# EAGLE board PCB2 (EAGLE 9.3.1)
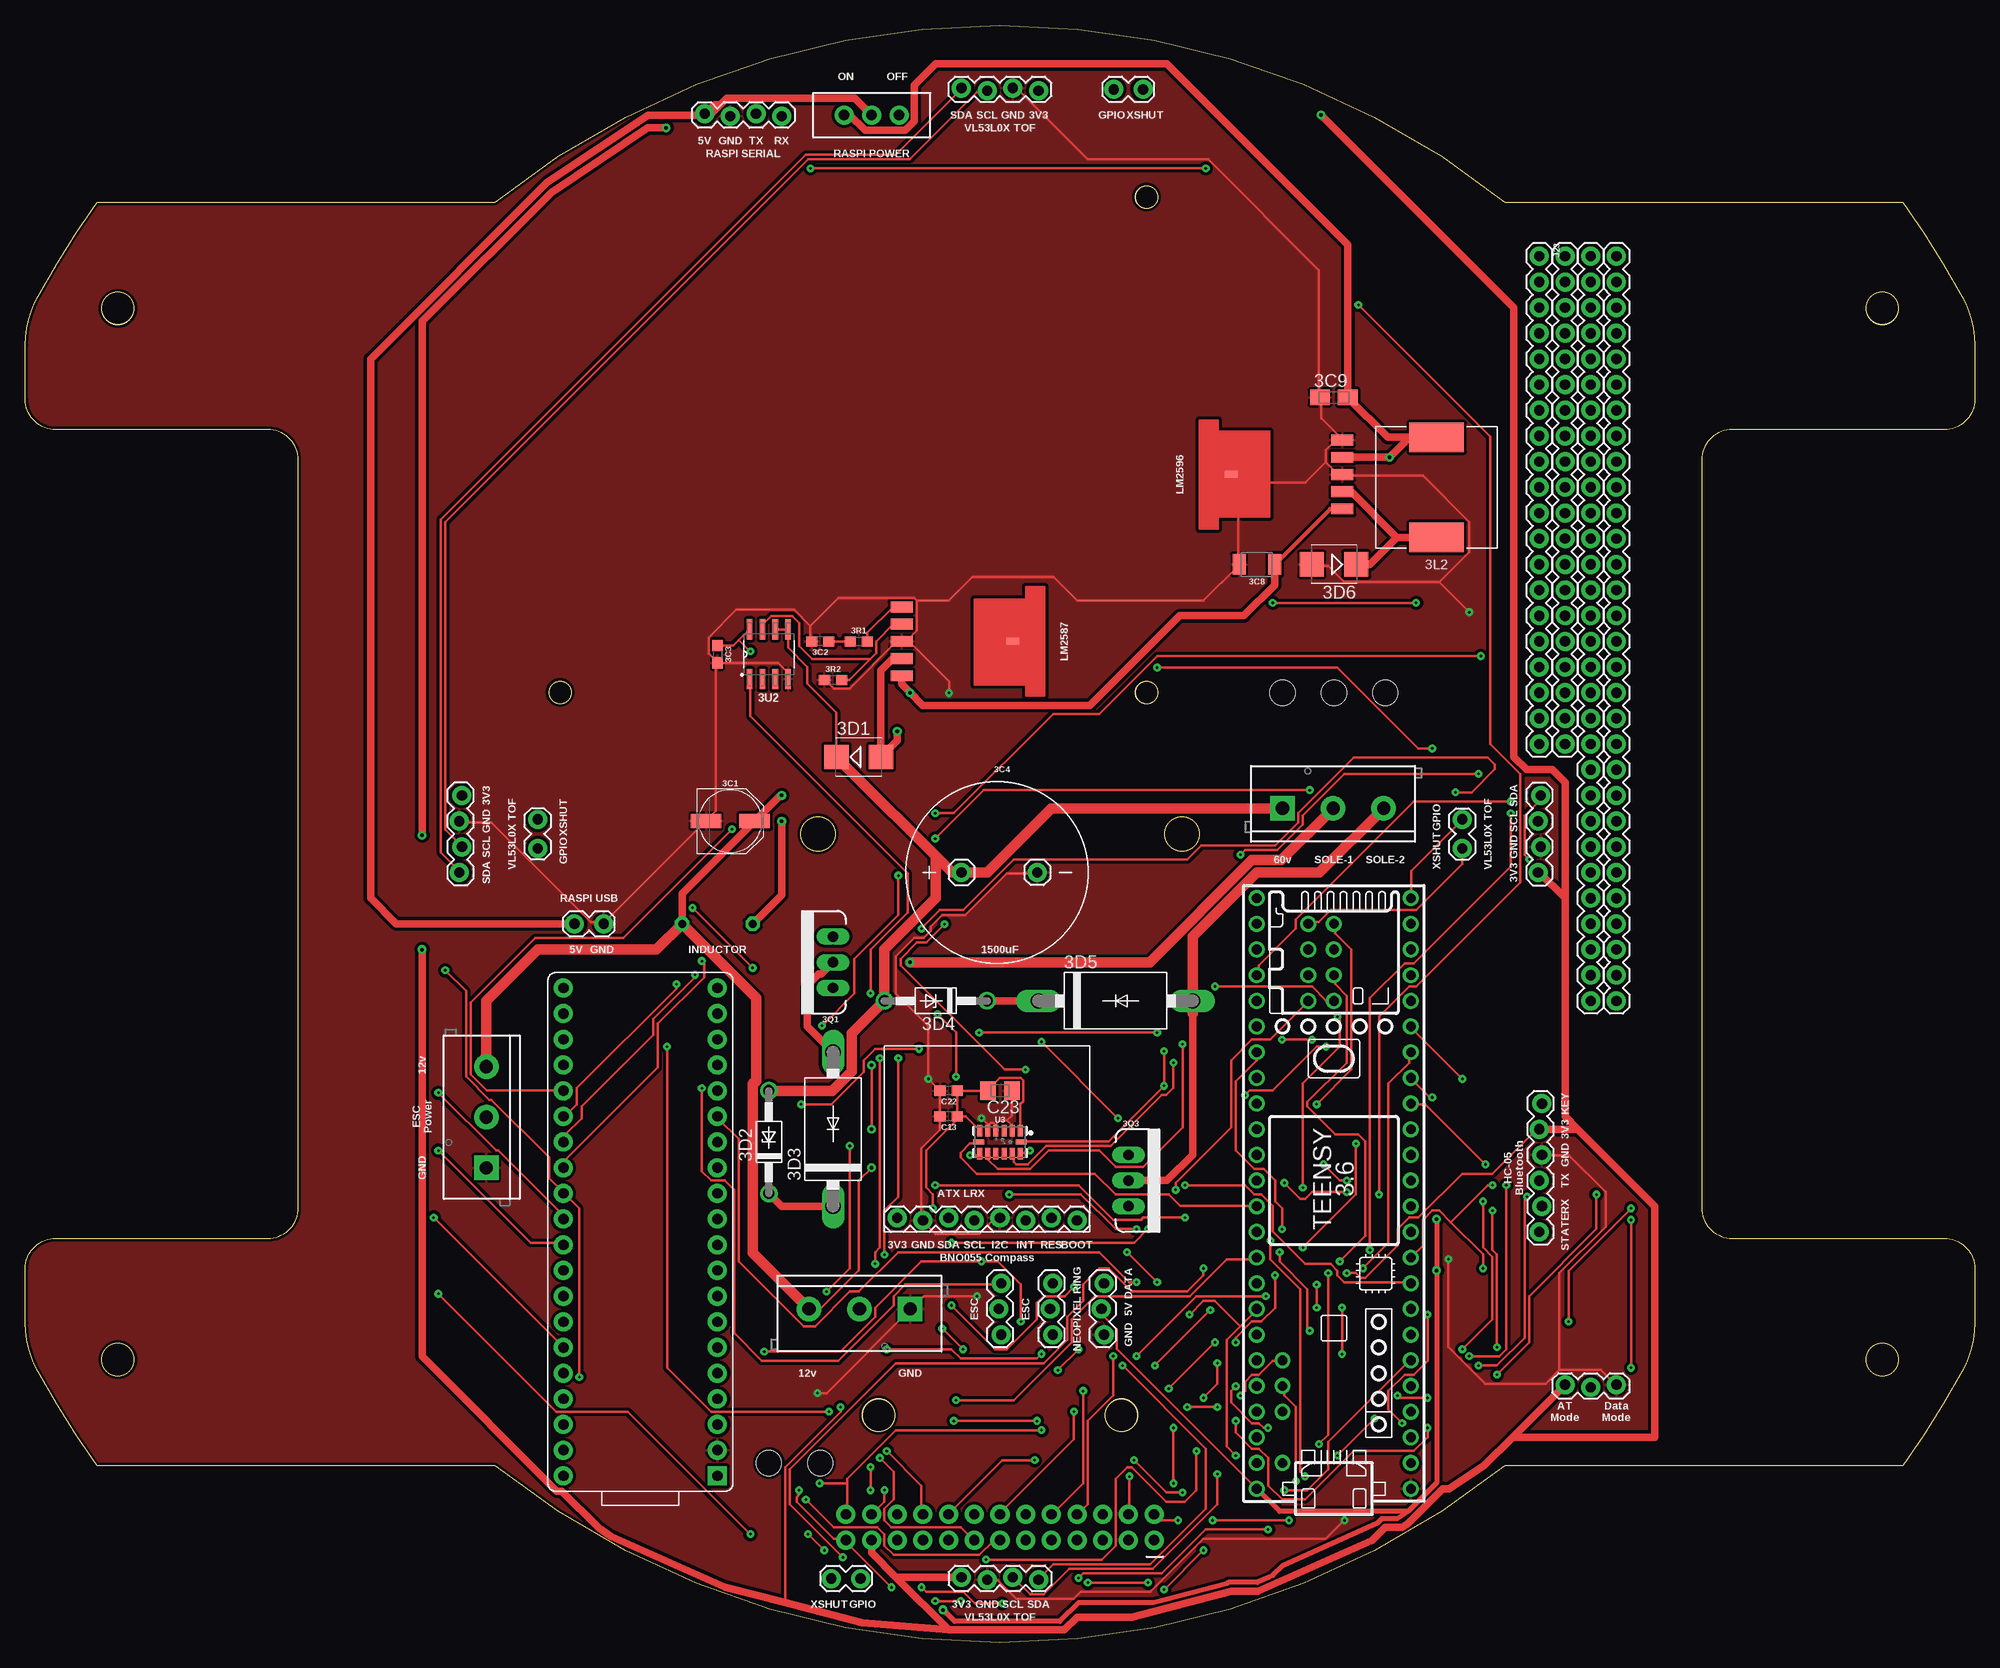
[diagram p2: board, top side]
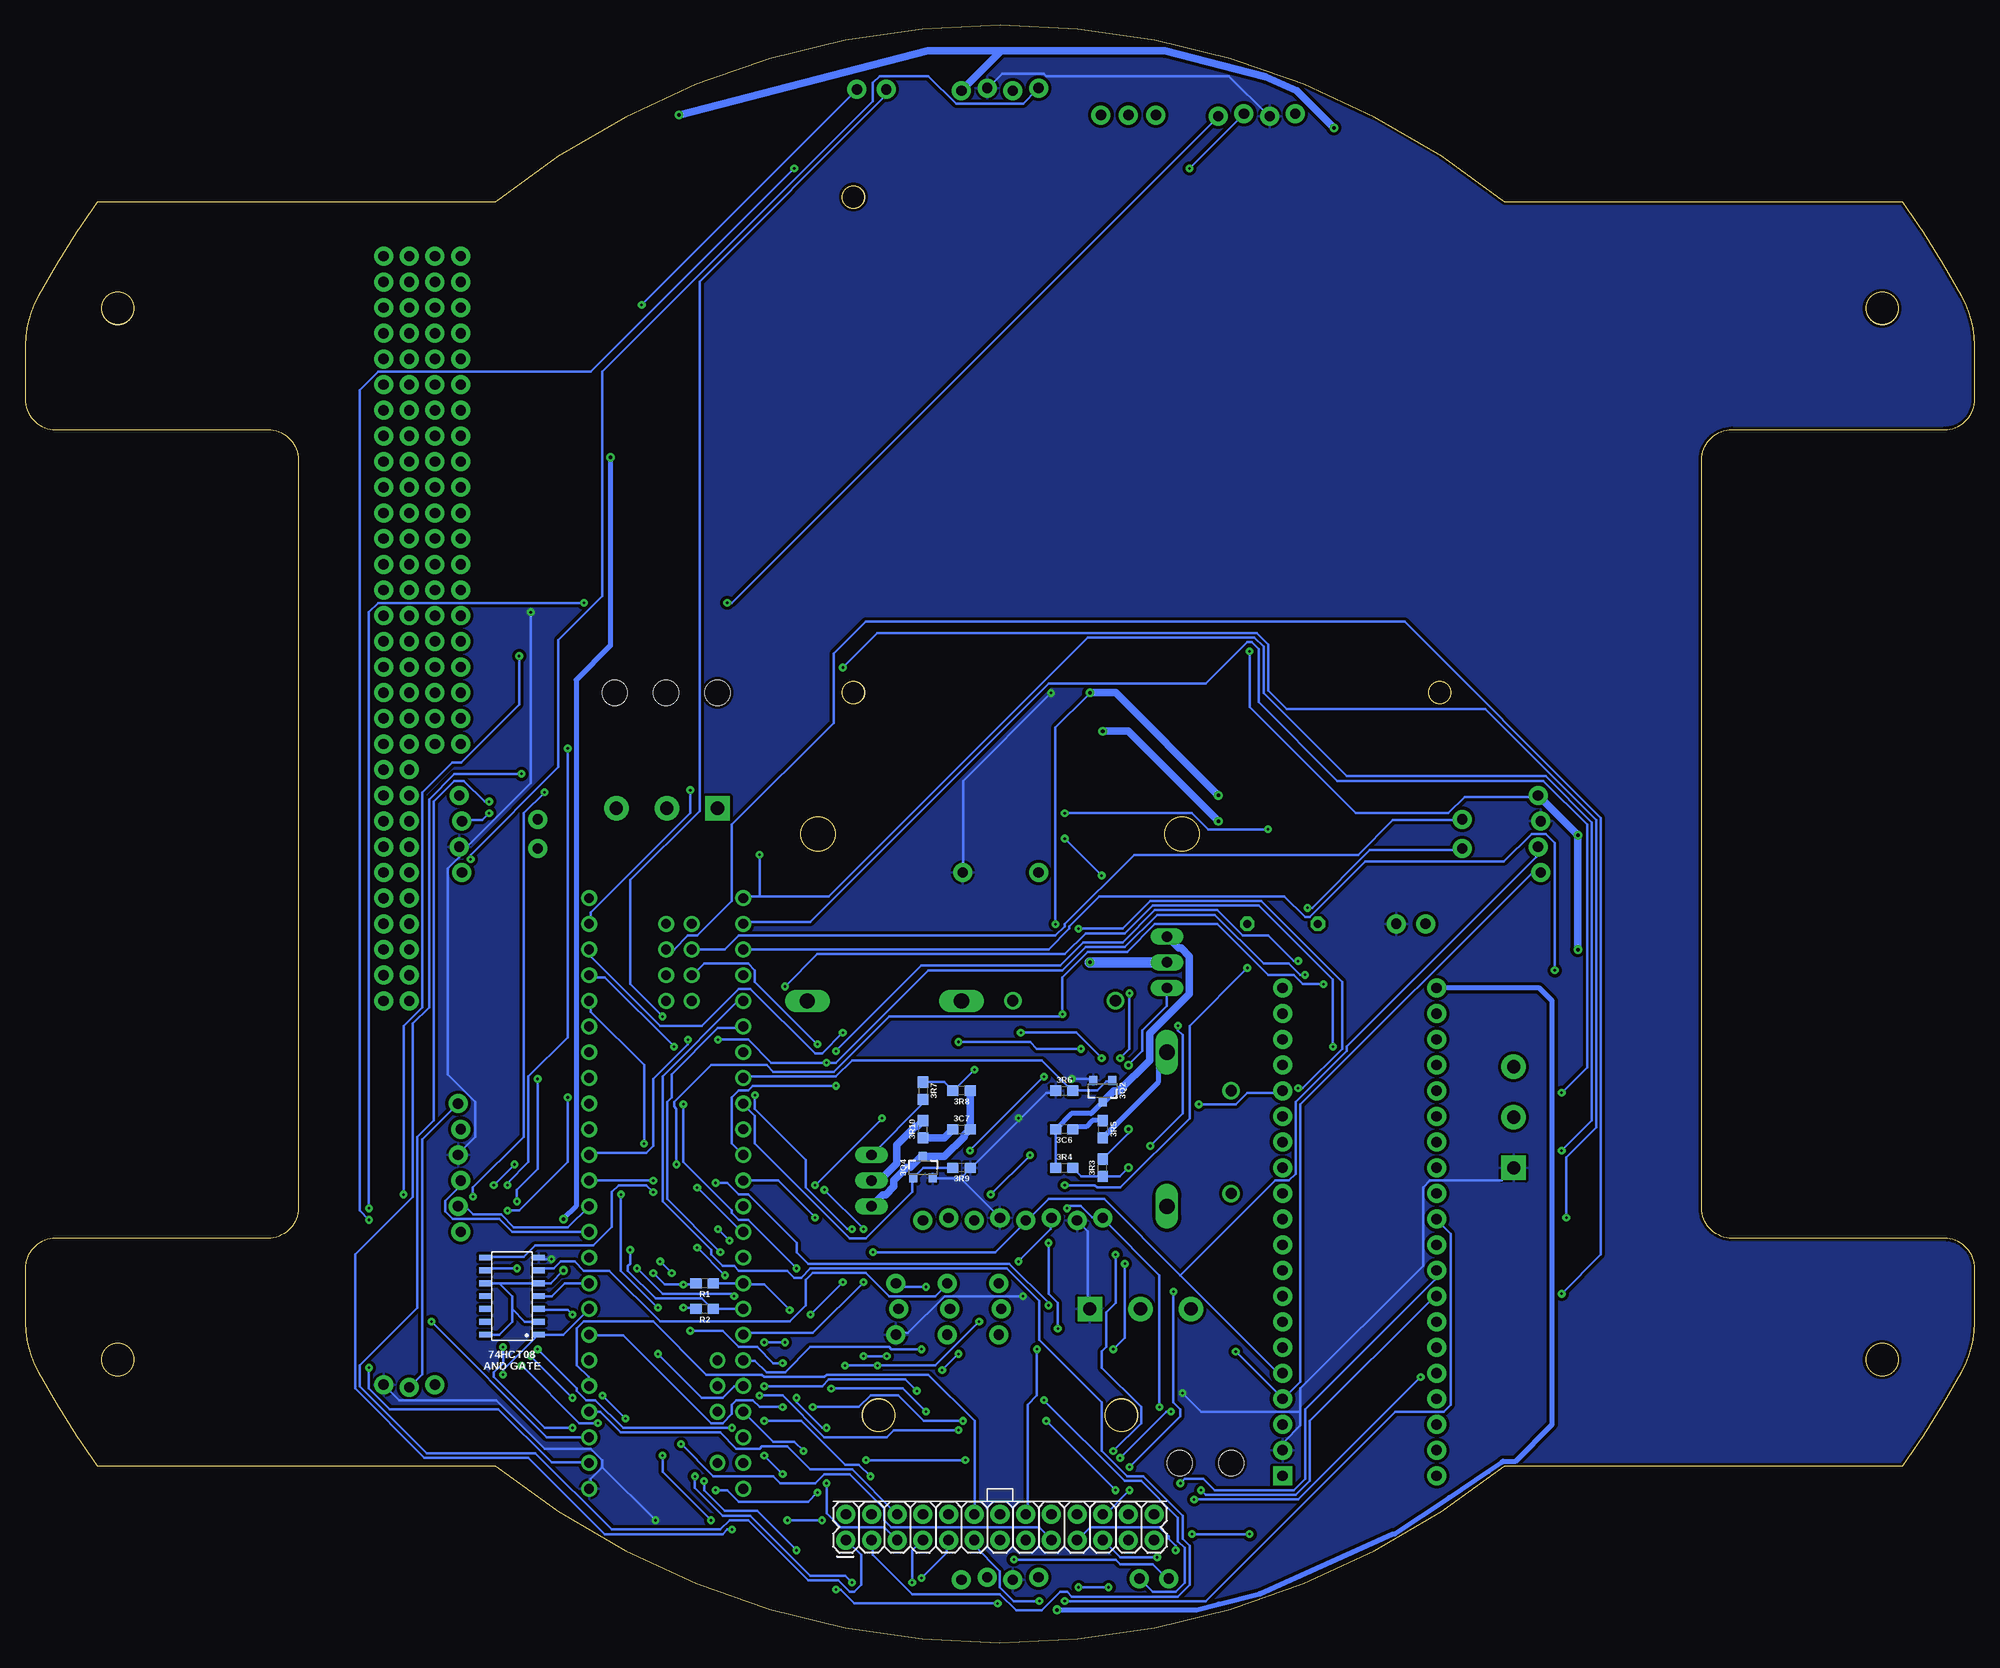
[diagram p3: board, bottom side, seen from below]

Size 192.79 x 160 mm. Coordinates in mm from the lower left corner, seen from the top.
Outline: 1.27,133.22 arc-6 7.11,142.52 46.48,142.52 arc-77 146.31,142.52 185.68,142.52 arc-6 191.52,133.22 arc-29 192.79,128.34 192.79,123 arc-90 189.79,120 168.8,120 arc90 165.8,117 165.8,43 arc90 168.8,40 189.79,40 arc-90 192.79,37 192.79,31.66 arc-29 191.52,26.77 arc-6 185.68,17.48 146.31,17.48 arc-77 46.48,17.48 7.11,17.48 arc-6 1.27,26.77 arc-29 0,31.66 0,37 arc-90 3,40 24,40 arc90 27,43 27,117 arc90 24,120 3,120 arc-90 0,123 0,128.34 arc-29 1.27,133.22
Outline: circle at 108.4,22.5 radius 1.6
Outline: circle at 84.4,22.5 radius 1.6
Outline: circle at 9.15,132 radius 1.6
Outline: circle at 183.64,132 radius 1.6
Outline: circle at 9.15,28 radius 1.6
Outline: circle at 183.64,28 radius 1.6
Outline: circle at 114.4,80 radius 1.7
Outline: circle at 78.4,80 radius 1.7
Outline: circle at 110.9,94 radius 1.1
Outline: circle at 110.9,143 radius 1.1
Outline: circle at 52.9,94 radius 1.1
Copper layers (1*16): Top 0.035mm / dielectric 1.5mm / Bottom 0.035mm
Design rules "mine *": minimum track width 10mil, minimum drill 10mil, track to track 8mil, track to pad 8mil, pad to pad 8mil, via to via 8mil, smd to smd 8mil, copper to edge 8mil, drill to drill 8mil, minimum pad ring 12mil, minimum via ring 10mil, stop-mask expansion 4mil, vias tented up to drill 25mil, thermal gap 10mil
Holes 2.5 mm at 73.54,17.77 78.62,17.77 129.42,93.97 134.5,93.97 124.34,93.97
Holes 3.2 mm at 9.15,132 9.15,28 84.4,22.5 108.4,22.5 183.64,28 183.64,132
Holes 3.4 mm at 114.4,80 78.4,80
Holes 2.2 mm at 52.9,94 110.9,94 110.9,143

## Footprints (pad centres in the part's own frame; a part is rotated, then mirrored left to right if it is on the bottom)
PANASONIC_D = smd 3 x 1.4: + 2.4,0; - -2.4,0
0603 = smd 1.1 x 1: 1 -0.85,0; 2 0.85,0
1000UF-CAP = drill 1.016 pad 1.88: + 0,0; - 7.5,0
1210 = smd 1.27 x 2.06: 1 -1.755,0; 2 1.755,0
A/3216-18R = smd 1.95 x 1.5: + 1.375,0; - -1.375,0
SMB = smd 2.4 x 2.4: A 2.2,0; C -2.2,0
DO41Z10 = drill 1.118: A 5.08,0; C -5.08,0
DO201-15 = drill 1.499 long: A 7.62,0; C -7.62,0
SCREWTERMINAL-5MM-3 = drill 1.3 pad 2.413 square: 1 0,0 | drill 1.3 pad 2.413: 2 5,0; 3 10,0
100UH-L = drill 0.8 octagon: P1 -3.5,0; P2 3.5,0
127 = smd 5.4 x 2.9: 1 0,4.95; 2 0,-4.95
TO220V = drill 1.016 long: 1 -2.54,0; 2 0,0; 3 2.54,0
SOT23-3 = smd 0.8 x 0.9: 1 -0.95,-1; 2 0.95,-1; 3 0,1.1
TO-263 = smd 2.16 x 1.07: P1 11,-3.4; P2 11,-1.7; P3 11,0; P4 11,1.7; P5 11,3.4 | smd 1.27 x 0.635: TAB 0,0
SOIC-8 = smd 1.981 x 0.559: 1 -2.464,1.905; 2 -2.464,0.635; 3 -2.464,-0.635; 4 -2.464,-1.905; 5 2.464,-1.905; 6 2.464,-0.635; 7 2.464,0.635; 8 2.464,1.905
R/2012-12R = smd 1.55 x 1.8: + 1.175,0; - -1.175,0
2X13 = drill 1.016 pad 1.88: 1 0,0; 2 0,2.54; 3 2.54,0; 4 2.54,2.54; 5 5.08,0; 6 5.08,2.54; 7 7.62,0; 8 7.62,2.54; 9 10.16,0; 10 10.16,2.54; 11 12.7,0; 12 12.7,2.54; 13 15.24,0; 14 15.24,2.54; 15 17.78,0; 16 17.78,2.54; 17 20.32,0; 18 20.32,2.54; 19 22.86,0; 20 22.86,2.54; 21 25.4,0; 22 25.4,2.54; 23 27.94,0; 24 27.94,2.54; 25 30.48,0; 26 30.48,2.54
1X04_LOCK = drill 1.016 pad 1.88: 1 0,0.127; 2 2.54,-0.127; 3 5.08,0.127; 4 7.62,-0.127
1X02_LOCK = drill 1.016 pad 1.88: 1 -0.178,0; 2 2.718,0
1X08_LOCK = drill 1.016 pad 1.88: 1 0,0.127; 2 2.54,-0.127; 3 5.08,0.127; 4 7.62,-0.127; 5 10.16,0.127; 6 12.7,-0.127; 7 15.24,0.127; 8 17.78,-0.127
1X03_LOCK = drill 1.016 pad 1.88: 1 0,0.127; 2 2.54,-0.127; 3 5.08,0.127
1X06_LOCK = drill 1.016 pad 1.88: 1 0,0; 2 2.54,-0.254; 3 5.08,0; 4 7.62,-0.254; 5 10.16,0; 6 12.7,-0.254
1X30 = drill 1.016 pad 1.88: 1 0,0; 2 2.54,0; 3 5.08,0; 4 7.62,0; 5 10.16,0; 6 12.7,0; 7 15.24,0; 8 17.78,0; 9 20.32,0; 10 22.86,0; 11 25.4,0; 12 27.94,0; 13 30.48,0; 14 33.02,0; 15 35.56,0; 16 38.1,0; 17 40.64,0; 18 43.18,0; 19 45.72,0; 20 48.26,0; 21 50.8,0; 22 53.34,0; 23 55.88,0; 24 58.42,0; 25 60.96,0; 26 63.5,0; 27 66.04,0; 28 68.58,0; 29 71.12,0; 30 73.66,0
1X20 = drill 1.016 pad 1.88: 1 0,0; 2 2.54,0; 3 5.08,0; 4 7.62,0; 5 10.16,0; 6 12.7,0; 7 15.24,0; 8 17.78,0; 9 20.32,0; 10 22.86,0; 11 25.4,0; 12 27.94,0; 13 30.48,0; 14 33.02,0; 15 35.56,0; 16 38.1,0; 17 40.64,0; 18 43.18,0; 19 45.72,0; 20 48.26,0
SWITCH_SPDT_PTH_11.6X4.0MM_LOCK = drill 1.016 pad 1.88: 1 0,2.718; 2 0,0; 3 0,-2.718
LGA-14 = smd 0.5 x 1.124: 1 2,1.138; 2 1.2,1.138; 3 0.4,1.138; 4 -0.4,1.138; 5 -1.2,1.138; 6 -2,1.138; 8 -2,-1.13; 9 -1.2,-1.138; 10 -0.4,-1.138; 11 0.4,-1.138; 12 1.2,-1.138; 13 2,-1.138 | smd 1.124 x 0.5: 7 -2.1,0; 14 2.1,0
TEENSY_3.5/3.6_BASIC = drill 0.965: 0/RX -25.4,-7.62; 1/TX -22.86,-7.62; 2 -20.32,-7.62; 3/CANTX -17.78,-7.62; 3V3 7.62,-7.62; 3V3_LO -22.86,7.62; 4/CANRX -15.24,-7.62; 5 -12.7,-7.62; 6 -10.16,-7.62; 7 -7.62,-7.62; 8 -5.08,-7.62; 9/CS -2.54,-7.62; 10/CS 0,-7.62; 11/MOSI 2.54,-7.62; 12/MISO 5.08,-7.62; 13/SCK 5.08,7.62; 14/A0 2.54,7.62; 15/A1 0,7.62; 16/A2 -2.54,7.62; 17/A3 -5.08,7.62; 18/A4/SDA -7.62,7.62; 19/A5/SCL -10.16,7.62; 20/A6 -12.7,7.62; 21/A7 -15.24,7.62; 21/DAC0 12.7,7.62; 22/A8 -17.78,7.62; 23/A9 -20.32,7.62; 24 10.16,-7.62; 25 12.7,-7.62; 26 15.24,-7.62; 27 17.78,-7.62; 28 20.32,-7.62; 29 22.86,-7.62; 30 25.4,-7.62; 31/A12 27.94,-7.62; 32/A13 30.48,-7.62; 33/A14 30.48,7.62; 34/A15 27.94,7.62; 35/A16 25.4,7.62; 36/A17 22.86,7.62; 37/A18 20.32,7.62; 38/A19 17.78,7.62; 39/A20 15.24,7.62; 43 20.32,0; 44 22.86,0; 45 25.4,0; 46 27.94,0; 47 27.94,2.54; 48 25.4,2.54; 49/A23 22.86,2.54; 50/A24 20.32,2.54; A10 -17.78,5.08; A11 -15.24,5.08; A22/DAC1 10.16,7.62; AGND -25.4,7.62; AREF -20.32,5.08; GND -27.94,-7.62; GND2 7.62,7.62; VIN -27.94,7.62; VUSB -25.4,5.08
20-DIP = drill 1.016 pad 1.88 square: 1 -24.13,-7.62 | drill 1.016 pad 1.88: 2 -21.59,-7.62; 3 -19.05,-7.62; 4 -16.51,-7.62; 5 -13.97,-7.62; 6 -11.43,-7.62; 7 -8.89,-7.62; 8 -6.35,-7.62; 9 -3.81,-7.62; 10 -1.27,-7.62; 11 1.27,-7.62; 12 3.81,-7.62; 13 6.35,-7.62; 14 8.89,-7.62; 15 11.43,-7.62; 16 13.97,-7.62; 17 16.51,-7.62; 18 19.05,-7.62; 19 21.59,-7.62; 20 24.13,-7.62; 21 24.13,7.62; 22 21.59,7.62; 23 19.05,7.62; 24 16.51,7.62; 25 13.97,7.62; 26 11.43,7.62; 27 8.89,7.62; 28 6.35,7.62; 29 3.81,7.62; 30 1.27,7.62; 31 -1.27,7.62; 32 -3.81,7.62; 33 -6.35,7.62; 34 -8.89,7.62; 35 -11.43,7.62; 36 -13.97,7.62; 37 -16.51,7.62; 38 -19.05,7.62; 39 -21.59,7.62; 40 -24.13,7.62
SOIC-14 = smd 1.18 x 0.58: P1 -2.66,3.81; P2 -2.66,2.54; P3 -2.66,1.27; P4 -2.66,0; P5 -2.66,-1.27; P6 -2.66,-2.54; P7 -2.66,-3.81; P8 2.66,-3.81; P9 2.66,-2.54; P10 2.66,-1.27; P11 2.66,0; P12 2.66,1.27; P13 2.66,2.54; P14 2.66,3.81

## Placement (x,y rotation side)
3C1  100uF  [PANASONIC_D]  69.73,81.27 0 top
3C2  680nF  [0603]  78.62,99.05 180 top
3C3  0.1uF  [0603]  68.46,97.78 270 top
3C4  1500uF  [1000UF-CAP]  92.59,76.19 0 top
3C6  1500pF  [0603]  90.05,50.79 180 bottom
3C7  1500pF  [0603]  100.21,50.79 0 bottom
3C8  22UF  [1210]  121.8,106.67 180 top
3C9  6.8uF  [A/3216-18R]  129.42,123.18 0 top
3D1  SS510  [SMB]  82.43,87.62 0 top
3D2  1N4728  [DO41Z10]  73.54,49.52 90 top
3D3  1N5401  [DO201-15]  79.89,50.79 90 top
3D4  1N4728  [DO41Z10]  90.05,63.49 180 top
3D5  1N5401  [DO201-15]  107.83,63.49 0 top
3D6  SS54  [SMB]  129.42,106.67 180 top
3J2  [SCREWTERMINAL-5MM-3]  124.34,82.54 0 top
3L1  100UH-L  [100UH-L]  68.46,71.11 0 top
3L2  33uH  [127]  139.58,114.29 180 top
3Q1  STP75NF75  [TO220V]  79.89,67.3 90 top
3Q2  AO3400  [SOT23-3]  86.24,54.6 180 bottom
3Q3  STP75NF75  [TO220V]  109.1,45.71 270 top
3Q4  AO3400  [SOT23-3]  104.02,46.98 0 bottom
3R1  2.94k  [0603]  82.43,99.05 0 top
3R2  1.69k  [0603]  79.89,95.24 0 top
3R3  1k  [0603]  86.24,46.98 90 bottom
3R4  10k  [0603]  90.05,46.98 0 bottom
3R5  20  [0603]  86.24,50.79 270 bottom
3R6  10k  [0603]  90.05,54.6 0 bottom
3R7  1k  [0603]  104.02,54.6 270 bottom
3R8  10k  [0603]  100.21,54.6 180 bottom
3R9  10k  [0603]  100.21,46.98 180 bottom
3R10  20  [0603]  104.02,50.79 90 bottom
3U1  LM2587  [TO-263]  97.67,99.05 180 top
3U2  [SOIC-8]  73.54,97.78 90 top
4U1  LM2596  [TO-263]  119.26,115.56 0 top
C13  0.1uF  [0603]  91.32,52.06 180 top
C22  0.1uF  [0603]  91.32,54.6 180 top
C23  10uf  [R/2012-12R]  96.4,54.6 180 top
J1  [2X13]  111.64,10.15 0 bottom
J2  [1X04_LOCK]  92.59,6.34 0 top
J3  [1X02_LOCK]  79.89,6.34 0 top
J4  [1X04_LOCK]  100.21,153.66 180 top
J5  [1X02_LOCK]  110.37,153.66 180 top
J6  [1X04_LOCK]  43.06,83.81 270 top
J7  [1X02_LOCK]  50.68,81.27 270 top
J8  [1X04_LOCK]  149.74,76.19 90 top
J9  [1X02_LOCK]  142.12,78.73 90 top
J10  [SCREWTERMINAL-5MM-3]  45.6,46.98 90 top
J12  [1X04_LOCK]  67.19,151.12 0 top
J13  [1X08_LOCK]  104.02,41.9 180 top
J14  [1X03_LOCK]  101.48,35.55 270 top
J15  [1X03_LOCK]  96.4,35.55 270 top
J16  [1X03_LOCK]  106.56,35.55 270 top
J17  [1X06_LOCK]  149.74,40.63 90 top
J18  [1X03_LOCK]  152.28,25.39 0 top
J19  [SCREWTERMINAL-5MM-3]  87.51,33.01 180 top
J20  [1X30]  157.36,137.15 270 top
J21  [1X30]  154.82,137.15 270 top
J22  [1X20]  152.28,137.15 270 top
J23  [1X20]  149.74,137.15 270 top
J26  [1X02_LOCK]  57.03,71.11 180 top
R1  1k  [0603]  125.61,35.55 180 bottom
R2  1k  [0603]  125.61,33.01 180 bottom
S1  [SWITCH_SPDT_PTH_11.6X4.0MM_LOCK]  83.7,151.12 90 top
U3  ADXL345  [LGA-14]  96.4,49.52 0 top
U$1  TEENSY_3.5/3.6_BASIC  [TEENSY_3.5/3.6_BASIC]  129.42,43.17 90 top
U$2  MAPLEMINI  [20-DIP]  60.84,40.63 90 top
U$3  74HCT08  [SOIC-14]  144.66,34.28 180 bottom

## Tracks (layer width: path | path; a pad name or v marks a point on that pad's centre or on a via)
3.3V  (via drill 0.25, 0.35)
  Top 0.254: 3U2.8 70.58,99.19 | 70.58,99.19 70.02,98.63 3C3.1 | C13.1 C22.1 95.13,54.6 | 95.13,54.6 C23.+ | C13.1 92.99,52.06 U3.6 | U3.1 98.4,53.28 98.68,53.56 98.68,55.64 98.44,55.87 96.4,55.87 95.13,54.6 | v89.77,42.97 89.77,44.34 89.08,45.02 89.08,48.68 92.28,51.88 C13.1 | v127.71,35.42 v127.71,33.14 | v130.69,36.56 131.6,36.56 132.06,36.11 132.51,36.11 135.71,39.31 135.71,40.91 136.86,42.05 137.77,42.05 142.12,46.39 145.09,46.39 149.43,50.74 J17.5 | v71.71,98.06 70.58,99.19 | v80.62,23.31 80.62,22.85 75.14,17.36 75.14,4.33 75.04,3.97
  Top 0.762: J1.23 83.7,8.88 86.11,6.47 | 86.11,6.47 J2.1 | 86.11,6.47 91.32,1.26 | 91.32,1.26 102.75,1.26 104.02,2.53 109.42,2.53 119.26,5.07 121.88,5.07 133.23,10.15 134.5,11.42 136.2,11.42 136.78,11.81 140.2,15.23 140.85,15.23 144.3,17.54 147.13,20.37 | 147.13,20.37 J18.1 | J17.5 153.55,50.79 | 153.55,50.79 161.17,43.17 161.17,20.31 147.2,20.31 147.13,20.37 | 153.55,50.79 152.28,52.06 152.28,73.65 | 152.28,73.65 149.74,76.19 J8.1 | 91.32,1.26 82.75,1.98 75.04,3.97 69.22,5.47 57.9,10.54 56.69,11.35 53.07,14.97 52.58,14.97 39.25,28.31 v39.25,68.57 | v39.25,79.87 39.25,130.7 51.99,143.45 61.56,149.85 v63.38,149.85 | v128.15,151.12 147.2,132.07 147.2,87.62 148.47,86.35 151.01,86.35 152.28,85.08 152.28,73.65
  Bottom 0.254: v89.77,42.97 89.54,43.19 88.39,43.19 87.25,42.05 86.34,42.05 J13.8 86.11,41.82 80.62,36.34 v80.62,23.31 | v127.71,33.14 126.57,33.14 R2.2 | R1.2 126.57,35.42 v127.71,35.42 129.54,35.42 v130.69,36.56 | v71.71,98.06 71.71,92.57 61.19,82.06 52.05,82.06 50.45,83.66 43.36,83.66 J6.1
  Bottom 0.762: v39.25,68.57 v39.25,79.87 J6.1 | v63.38,149.85 67.03,153.5 70.15,154.9 80.1,157.47 96.27,157.47 | 96.27,157.47 J4.1 | 96.27,157.47 103.55,157.47 v128.15,151.12
5V  (via drill 0.35)
  Top 0.254: U$1.VIN 107.95,29.07 107.95,30.99 106.43,32.52 J16.2
  Top 0.508: 136.76,12.97 139.58,15.79 v139.58,36.82 v139.58,41.9 | 136.76,12.97 124.06,12.97 U$1.VIN | 136.76,12.97 135.69,12.26 134.15,12.26 133.69,11.8 124.34,7.61 123.39,6.66 123,6.49 121.84,5.97 118.97,5.97 118.82,5.82 111.59,3.96 104.17,3.96 102.31,2.1 91.91,2.1 v90.76,3.24
  Top 0.762: 4U1.P4 v134.93,117.26 136.91,119.24 | 136.91,119.24 3L2.2 | 136.91,119.24 134.73,119.24 3C9.+ 130.79,138.31 112.91,156.2 90.05,156.2 87.94,154.09 87.94,150.49 87.04,149.59 83.06,149.59 81.54,151.12 S1.1
  Bottom 0.254: U$3.P10 145.93,35.55 | 145.93,35.55 144.66,34.28 144.66,33.01 | 144.66,33.01 144.66,31.74 145.93,30.47 U$3.P14 | 144.66,33.01 143.39,31.74 U$3.P2 | 145.93,35.55 U$3.P5 140.85,35.55 v139.58,36.82
  Bottom 0.508: v134.93,117.26 134.93,98.62 138.31,95.24 138.31,43.17 v139.58,41.9 | v90.76,3.24 76.95,3.24 74.81,3.8 70.72,4.85 57.53,10.76 57.35,10.76 51.99,14.34 | 51.99,14.34 | 51.99,14.34 48.1,16.94 46.78,17.83 46.65,17.95 45.41,17.95 41.79,21.58 41.79,63.49 43.06,64.76 U$2.21
12V  (via drill 0.25, 0.35)
  Top 0.254: J19.3 78.62,33.01 82.43,36.82 82.43,45.71 v83.7,46.98 | v98.91,56.68 96.85,56.68 86.57,66.97 86.57,67.65 88.17,69.25 89.08,69.25 v90.91,71.08
  Top 0.381: 3C8.1 129.04,112.16 4U1.P1
  Top 0.762: v74.81,83.81 74.67,83.81 3C1.+ 64.96,74.1 3L1.P1 | 3U1.P5 86.67,94.81 v87.51,93.97 88.78,92.7 105.29,92.7 114.18,101.59 120.53,101.59 123.55,104.61 3C8.1
  Top 1.016: J19.3 71.96,38.55 71.96,55.25 72.27,55.56 72.27,63.8 3L1.P1 62.42,68.57 50.68,68.57 45.6,63.49 J10.3
  Bottom 0.254: 3R4.2 88.35,46.13 3R3.1 84.55,46.13 v83.7,46.98 | 3R7.1 101.91,55.45 3R8.2 100.97,54.62 v98.91,56.68 | v90.91,71.08 90.91,90.51 87.71,93.71 v87.51,93.97
  Bottom 0.762: v74.81,83.81 84.97,93.97 v87.51,93.97
CS_ADXL
  Top 0.254: U3.7 94.11,49.37 93.42,49.37 92.51,48.45 92.51,47.99 94.11,46.39 105.77,46.39 107.83,44.34 113.08,44.34 114.23,43.19 121.77,43.19 U$1.15/A1
CS_MAPLE  (via drill 0.25)
  Top 0.254: v109.88,35.65 109.2,35.65 106.23,38.62 86.34,38.62 82.45,34.74 81.54,34.74 78.11,31.31 76.96,31.31 70.56,37.71 70.56,49.82 68.51,51.88 U$2.15
  Bottom 0.254: v109.88,35.65 114.91,30.62 121.77,30.62 U$1.20/A6
CS_POT  (via drill 0.25)
  Top 0.254: v83.59,64.23 83.59,68.57 87.25,72.23 87.25,76.11 71.71,91.66 71.71,95.31 3U2.1 | v84.51,57.82 84.51,39.08 84.05,38.62 v84.05,37.48 | v85.19,29.02 91.59,29.02 92.51,28.11 100.05,28.11 v100.51,28.56 | v104.17,29.02 v102.11,26.96
  Bottom 0.254: v83.59,64.23 83.59,58.74 v84.51,57.82 | v84.05,37.48 84.05,30.16 v85.19,29.02 | v102.11,26.96 v100.51,28.56 | v104.17,29.02 107.14,29.02 107.37,29.25 115.14,29.25 117.66,26.73 119.48,26.73 120.63,27.88 121.77,27.88 U$1.21/A7
CSM1  (via drill 0.25)
  Top 0.254: v117.66,64.91 127.26,64.91 128.63,63.54 129.31,63.54 U$1.43 | v63.48,58.97 63.48,27.19 67.82,22.85 v79.48,22.85 | v84.51,18.28 85.88,16.9 85.88,14.16 84.97,13.25 84.97,12.1 85.65,11.42 92.51,11.42 93.65,10.28 J1.15
  Bottom 0.254: v117.66,64.91 114.45,68.11 89.99,68.11 87.94,70.17 84.05,70.17 81.31,72.91 70.79,72.91 63.48,65.6 v63.48,58.97 | v79.48,22.85 79.94,22.85 v84.51,18.28
CSM2  (via drill 0.25)
  Top 0.254: v130,37.71 132.51,40.22 132.51,49.59 131.83,50.28 129.54,50.28 126.8,53.02 126.8,53.48 130.69,57.37 130.69,64 129.54,65.14 129.54,65.83 U$1.44 | v128.86,36.56 128.86,20.56 v127.94,19.65
  Bottom 0.254: v128.86,36.56 v130,37.71 | v127.94,19.65 124.74,16.45 118.8,16.45 118.11,15.76 114.68,15.76 113.77,16.68 111.25,16.68 107.83,13.25 107.83,12.1 107.14,11.42 92.51,11.42 91.37,10.28 J1.17
CSM3  (via drill 0.25)
  Top 0.254: v40.85,34.51 52.5,22.85 59.59,22.85 v71.71,10.73 | v79.02,9.13 v77.42,10.73
  Bottom 0.254: U$1.45 128.63,68.57 127.26,69.94 126.34,69.94 122.91,73.37 122.91,80.91 112.85,90.97 112.85,97.83 109.65,101.03 56.39,101.03 36.96,81.6 36.96,38.39 v40.85,34.51 | v77.42,10.73 v71.71,10.73 | v79.02,9.13 79.02,9.59 79.71,10.28 79.71,10.5 80.62,11.42 87.48,11.42 88.62,10.28 J1.19
CSM4  (via drill 0.25)
  Top 0.254: v127.71,53.25 131.14,56.68 131.14,68.57 129.54,70.17 129.54,71.08 U$1.46 | v116.51,37.02 116.51,36.34 114.91,34.74 109.43,34.74 107.14,37.02 106.23,37.02 104.63,35.42 104.63,33.82 103.02,32.22 103.02,29.94 100.74,27.65 86.11,27.65 75.59,17.13 75.59,13.7 v80.85,8.45
  Bottom 0.254: v127.71,53.25 127.71,47.54 122.91,42.74 122.91,42.51 122.23,41.82 121.31,41.82 v116.51,37.02 | v80.85,8.45 84.51,8.45 86.11,10.05 J1.21
GATE1  (via drill 0.25)
  Top 0.254: v125.66,15.99 125.66,23.31 124.51,24.45 124.51,25.36 U$1.A10 | v112.63,5.25 v116.51,9.13 | v96.62,3.87 93.88,3.87 92.74,5.02 89.08,5.02 v88.62,5.47 | v85.65,5.47 81.08,10.05 J1.25 81.08,10.28 79.94,10.28 76.28,13.93 76.28,14.39 76.51,14.62 v76.51,15.08
  Bottom 0.254: v125.66,15.99 125.66,15.08 123.6,13.02 120.4,13.02 v116.51,9.13 | v112.63,5.25 112.17,5.25 110.8,3.87 v96.62,3.87 | v85.65,5.47 v88.62,5.47 | v76.51,15.08 76.05,14.62 67.13,14.62 65.76,15.99 65.76,21.93 53.42,34.28 U$2.33
GATE2  (via drill 0.25)
  Top 0.254: v120.17,24.45 120.63,24.91 120.63,25.82 121.31,26.51 122,26.51 123.37,27.88 124.28,27.88 U$1.A11 | v100.51,21.02 86.11,21.02 81.31,16.22 81.31,15.76 | 81.31,15.76 81.31,12.79 J1.26 | 81.31,15.76 v78.56,15.76
  Bottom 0.254: v120.17,24.45 117.88,24.45 113.77,20.33 107.6,20.33 106.91,21.02 v100.51,21.02 | v78.56,15.76 78.11,16.22 76.28,16.22 75.14,15.08 67.36,15.08 66.22,16.22 66.22,23.08 53.42,35.88 53.42,36.79 U$2.32
GND  (via drill 0.25)
  Top 0.254: v140.74,37.94 140.74,29.25 144.4,25.59 150.35,25.59 151.72,26.96 | 151.72,26.96 155.83,26.96 157.2,25.59 J18.3 | v130.46,12.1 128.63,10.28 116.51,10.28 111.25,5.02 104.4,5.02 103.71,4.33 98,4.33 96.17,6.16 95.25,6.16 J2.2 | 151.72,26.96 151.72,36.56 156.29,41.14 156.29,44.57 152.63,48.22 150.12,48.22 J17.4 | v94.11,34.28 88.85,34.28 87.71,33.14 J19.1 87.48,32.91 79.25,24.68 v78.34,24.68 | 95.25,51.19 95.25,50.74 U3.5 95.25,51.19 | 95.25,51.19 95.48,51.42 95.71,51.42 95.94,51.19 | 95.94,51.19 95.94,50.74 U3.4 95.94,51.19 | 97.08,51.65 97.54,51.19 97.54,50.74 U3.2 | 97.08,51.65 96.4,51.65 95.94,51.19 | 97.08,51.65 97.54,52.11 97.54,54.4 C23.- | v94.57,51.88 95.25,51.19 | 3C4.- 100.05,76.11 97.08,76.11 92.97,72 90.68,72 89.54,70.85 89.54,70.4 88.85,69.71 87.94,69.71 86.11,67.88 86.11,64.23 89.31,61.02 v89.31,55.77 90.45,54.62 C22.2 90.45,54.4 90.45,52.11 C13.2 90.45,51.88 90.45,50.74 88.62,48.91 88.62,41.82 J13.7 88.85,41.59 89.99,40.45 94.34,40.45 95.71,41.82 96.4,41.82 J13.4 | 3R2.1 79.25,95.09 79.94,94.4 81.54,94.4 86.11,98.97 86.57,98.97 3U1.P3 | 3C3.2 68.51,96.91 74.45,96.91 75.36,96 75.36,95.31 3U2.4 | 77.65,100.57 77.65,99.2 3C2.2 | 77.65,100.57 76.05,102.17 70.34,102.17 67.59,99.43 67.59,97.83 68.28,97.14 3C3.2 | 87.25,99.2 86.79,99.2 3U1.P3 | 87.25,99.2 88.17,100.12 88.17,103.09 | 88.17,103.09 87.94,103.32 80.39,103.32 77.65,100.57 | J6.2 43.13,81.14 46.1,81.14 55.93,71.31 57.08,71.31 J26.1 57.3,71.31 67.13,81.14 3C1.- 67.36,81.37 68.28,82.28 68.28,96.91 3C3.2 | 119.94,114.75 119.94,106.74 3C8.2 119.94,106.52 116.51,103.09 104.02,103.09 101.7,105.4 93.63,105.4 91.32,103.09 88.17,103.09
  Top 0.254: 119.94,114.75 119.26,115.43 4U1.TAB | 130,119.32 130.23,119.09 4U1.P5 130,119.32 | 130,119.32 128.17,121.15 128.17,122.98 3C9.- 127.94,123.2 127.94,135.78 116.97,146.75 105.08,146.75 98.22,153.61 97.77,153.61 J4.2 | 128.63,116.8 129.77,115.66 130.23,115.66 4U1.P3 130.46,115.43 138.23,115.43 142.8,110.86 142.8,107.89 139.83,104.92 | 128.63,116.8 128.63,117.95 130,119.32 | 139.83,104.92 130.46,104.92 128.86,106.52 127.26,106.52 3D6.A | 119.94,114.75 126.57,114.75 128.63,116.8 | v91.37,93.94 91.37,95.09 87.25,99.2 | 87.25,99.2 3U1.P3 | 139.83,104.92 v142.8,101.94
  Bottom 0.254: v140.74,37.94 141.89,37.94 U$3.P7 | 135.71,17.36 136.86,16.22 136.86,15.3 U$1.GND | 135.71,17.36 135.71,18.05 136.86,19.19 141.43,19.19 146.23,23.99 155.83,23.99 J18.3 | 135.71,17.36 v130.46,12.1 | J17.4 149.89,48.45 148.29,50.05 148.29,53.48 151.03,56.22 151.03,76.57 149.89,77.71 149.89,78.63 J8.2 149.66,78.86 148.97,78.86 142.8,85.03 v142.8,101.94 | 66.68,22.85 66.68,25.13 54.56,37.25 54.56,45.02 53.88,45.71 46.79,45.71 45.65,46.85 J10.1 | 66.68,22.85 66.68,21.48 68.28,19.88 68.28,19.19 U$2.2 | v94.11,34.28 101.88,34.28 105.54,30.62 106.68,30.62 J16.3 | 100.28,45.94 103.02,45.94 3Q4.2 | 100.28,45.94 99.37,46.85 3R9.1 99.14,47.08 94.34,51.88 | 94.34,51.88 91.82,54.4 90.91,54.4 3R6.1 | 94.34,51.88 v94.57,51.88 | 100.28,45.94 96.4,42.05 J13.4 | v89.31,55.77 87.25,55.77 3Q2.2 | J19.1 87.71,33.14 87.71,40.68 88.62,41.59 J13.7 | 66.68,22.85 76.51,22.85 v78.34,24.68 | J12.2 69.88,151.09 73.76,154.98 91.82,154.98 92.05,155.21 96.17,155.21 97.54,153.84 J4.2 | v91.37,93.94 100.05,85.26 100.05,76.34 3C4.-
  pour Top (isolate 0.305): 1.27,26.77 arc-29 0,31.66 0,37 arc-90 3,40 24,40 arc90 27,43 27,117 arc90 24,120 3,120 arc-90 0,123 0,128.34 arc-29 1.27,133.22 arc-6 7.11,142.52 46.48,142.52 arc-77 146.31,142.52 185.68,142.52 arc-6 191.52,133.22 arc-29 192.79,128.34 192.79,123 arc-90 189.79,120 168.8,120 arc90 165.8,117 165.8,43 arc90 168.8,40 189.79,40 arc-90 192.79,37 192.79,31.66 arc-29 191.52,26.77 arc-6 185.68,17.48 146.31,17.48 arc-77 46.48,17.48 7.11,17.48 arc-6
  pour Bottom (isolate 0.305): 191.52,133.22 arc-29 192.79,128.34 192.79,123 arc-90 189.79,120 168.8,120 arc90 165.8,117 165.8,43 arc90 168.8,40 189.79,40 arc-90 192.79,37 192.79,31.66 arc-29 191.52,26.77 arc-6 185.68,17.48 146.31,17.48 arc-77 46.48,17.48 7.11,17.48 arc-6 1.27,26.77 arc-29 0,31.66 0,37 arc-90 3,40 24,40 arc90 27,43 27,117 arc90 24,120 3,120 arc-90 0,123 0,128.34 arc-29 1.27,133.22 arc-6 7.11,142.52 46.48,142.52 arc-77 146.31,142.52 185.68,142.52 arc-6
GPIO1  (via drill 0.25)
  Top 0.254: v92.05,23.99 97.77,23.99 103.48,29.71 103.48,31.99 105.77,34.28 115.14,34.28 118.8,37.94 121.77,37.94 U$1.17/A3
  Bottom 0.254: v92.05,23.99 84.05,15.99 82.45,15.99 78.79,12.33 78.79,10.05 78.11,9.36 78.11,5.93 79.02,5.02 81.31,5.02 82.45,6.16 J3.2
GPIO2  (via drill 0.25)
  Top 0.254: v126.34,45.02 126.34,55.31 130,58.97 130,61.71 v129.77,61.94
  Bottom 0.254: v126.34,45.02 122,40.68 U$1.16/A2 | v129.77,61.94 132.97,65.14 132.97,75.43 126.11,82.28 126.11,134.63 107.83,152.92 107.83,153.61 J5.2
GPIO3  (via drill 0.25)
  Top 0.254: v114.68,42.05 110.57,42.05 110.34,41.82 107.6,41.82 104.17,45.25 v89.99,45.25 | v65.99,72.68 v71.94,66.74
  Bottom 0.254: U$1.14/A0 118.34,45.71 v114.68,42.05 | v89.99,45.25 87.02,45.25 86.79,45.02 84.51,45.02 77.65,51.88 77.65,61.02 v71.94,66.74 | v65.99,72.68 65.53,72.68 59.82,78.4 50.68,78.4 J7.2
GPIO4
  Top 0.254: U$1.32/A13 137.09,73.83 137.09,76.34 142.12,81.37 J9.2
INAM1  (via drill 0.25)
  Top 0.254: v144.4,47.31 138.46,53.25 137.09,53.25 U$1.24 | v146.46,45.25 146.46,29.02 145.77,28.33 v142.8,28.33 | v138.69,24.22 135.94,24.22 v135.71,24.45 | v129.77,18.51 v133.43,22.16 | v117.43,12.1 v124.97,12.1 | v114,12.1 112.17,12.1 111.71,12.56 J1.2
  Bottom 0.254: v146.46,45.25 v144.4,47.31 | v138.69,24.22 v142.8,28.33 | v133.43,22.16 v135.71,24.45 | v129.77,18.51 129.77,16.9 v124.97,12.1 | v114,12.1 v117.43,12.1
INAM2  (via drill 0.25)
  Top 0.254: v132.29,37.02 134.8,39.54 134.8,55.31 136.86,57.37 136.86,58.28 U$1.26 | v122.68,34.28 115.83,34.28 v109.88,28.33 | v107.6,28.33 107.6,24.45 105.08,21.93 105.08,13.7 104.17,12.79 J1.8
  Bottom 0.254: v132.29,37.02 129.77,34.51 122.91,34.51 v122.68,34.28 | v107.6,28.33 v109.88,28.33
INAM3  (via drill 0.25)
  Top 0.254: v131.6,49.37 131.6,44.34 v126.34,39.08 | v123.6,36.34 123.6,33.14 122.23,31.76 121.31,31.76 119.71,30.16 v119.71,29.71 | v113.08,25.13 v117.66,29.71 | v103.71,22.85 103.71,20.11 96.4,12.79 J1.14
  Bottom 0.254: v131.6,49.37 131.6,57.14 136.86,62.4 136.86,63.31 U$1.28 | v123.6,36.34 v126.34,39.08 | v117.66,29.71 v119.71,29.71 | v113.08,25.13 106,25.13 v103.71,22.85
INAM4  (via drill 0.25)
  Top 0.254: v94.34,60.34 v111.94,60.34 | v86.34,57.82 86.34,44.11 84.97,42.74 v84.97,38.39 | v85.19,18.96 88.62,15.53 88.62,12.79 J1.20
  Bottom 0.254: v111.94,60.34 114,58.28 114.68,58.28 121.08,64.68 122.23,64.68 125.88,61.02 130,61.02 136.86,67.88 136.86,68.57 U$1.30 | v94.34,60.34 88.85,60.34 v86.34,57.82 | v84.97,38.39 84.97,33.59 85.88,32.68 85.88,29.25 86.34,28.79 86.34,27.19 82.45,23.31 82.45,21.71 v85.19,18.96
INBM1  (via drill 0.25)
  Top 0.254: v139.14,53.94 138.92,53.94 137.09,55.77 U$1.25 | v145.09,42.74 145.09,38.85 145.54,38.39 v145.54,29.25 | v138.69,21.25 138.69,20.33 137.31,18.96 131.37,18.96 126.57,14.16 124.28,14.16 122.91,15.53 122.91,18.28 122,19.19 121.31,19.19 119.71,20.79 v119.71,21.93 | v109.2,16.45 109.2,12.79 J1.4
  Bottom 0.254: v139.14,53.94 139.14,47.54 143.94,42.74 v145.09,42.74 | v145.54,29.25 145.54,27.65 146.46,26.73 146.46,26.28 141.43,21.25 v138.69,21.25 | v119.71,21.93 116.06,21.93 111.71,17.59 110.34,17.59 v109.2,16.45
INBM2  (via drill 0.25)
  Top 0.254: v142.12,55.77 137.09,60.8 U$1.27 | v144.17,43.65 144.17,39.08 145.09,38.16 145.09,31.99 v142.12,29.02 | v122.91,21.25 122.46,21.25 122,21.71 121.31,21.71 119.26,23.76 119.26,24.91 v119.71,25.36 | v104.63,24.91 104.63,15.76 101.65,12.79 J1.10
  Bottom 0.254: v142.12,55.77 142.12,46.85 144.17,44.79 v144.17,43.65 | v142.12,29.02 138.23,25.13 138.23,24.91 137.31,23.99 136.4,23.99 133.66,21.25 v122.91,21.25 | v119.71,25.36 114,25.36 113.31,26.05 105.77,26.05 v104.63,24.91
INBM3  (via drill 0.25)
  Top 0.254: v128.63,58.97 127.71,58.97 123.37,54.62 121.08,54.62 v120.63,54.17 | v111.03,40.91 109.65,39.54 v91.59,39.54 | v92.74,29.02 v90.68,31.08
  Bottom 0.254: v128.63,58.97 135.49,65.83 136.86,65.83 U$1.29 | v120.63,54.17 120.63,52.8 115.6,47.77 115.6,45.02 111.48,40.91 v111.03,40.91 | v91.59,39.54 91.59,34.51 90.68,33.59 v90.68,31.08 | v92.74,29.02 92.74,24.45 93.65,23.53 93.65,12.79 J1.16
INBM4  (via drill 0.25)
  Top 0.254: v127.03,84.34 94.8,84.34 v89.99,79.54 | v86.34,75.88 86.34,72 81.99,67.65 81.99,64.23 v78.79,61.02 | v81.54,49.14 81.54,37.02 v79.25,34.74 | v83.59,15.08 v83.59,17.36
  Bottom 0.254: v127.03,84.34 127.03,82.06 136.86,72.23 136.86,71.31 U$1.31/A12 | v86.34,75.88 v89.99,79.54 | v78.79,61.02 78.79,60.57 78.34,60.11 78.34,52.34 v81.54,49.14 | v79.25,34.74 79.25,23.76 78.56,23.08 78.56,22.39 v83.59,17.36 | v83.59,15.08 86.11,12.56 J1.22
INT1  (via drill 0.25)
  Top 0.254: v93.42,48.22 94.34,48.22 U3.8 | v97.31,44.34 104.4,44.34 107.83,40.91 v109.88,40.91 | v113.77,44.79 113.77,45.48 119.26,50.97 119.26,57.6 121.31,59.65 123.14,59.65 126.8,63.31 U$1.50/A24
  Bottom 0.254: v97.31,44.34 v93.42,48.22 | v113.77,44.79 v109.88,40.91
INT2  (via drill 0.25)
  Top 0.254: v114.45,59.2 114.45,50.97 110.57,47.08 107.83,47.08 106.23,48.68 101.2,48.68 99.37,46.85 96.17,46.85 95.25,47.77 95.25,48.22 U3.9
  Bottom 0.254: v114.45,59.2 120.63,65.37 120.63,66.51 121.31,67.2 125.66,67.2 126.8,66.05 U$1.49/A23
LSOUT1  (via drill 0.25)
  Top 0.254: v40.85,48.68 49.99,39.54 53.19,39.54 U$2.31 | v104.17,6.39 104.63,6.85 112.4,6.85 116.74,11.19 v122.91,11.19 | v143.72,85.94 130.46,85.94 126.34,81.83 126.34,80.91 123.83,78.4 120.63,78.4 v120.17,77.94
  Bottom 0.254: 120.17,73.83 113.31,73.83 87.71,99.43 71.25,99.43 70.34,98.52 70.34,93.94 62.11,85.71 42.45,85.71 37.87,81.14 37.87,51.65 v40.85,48.68 | 120.17,73.83 121.77,73.83 U$1.33/A14 | v104.17,6.39 101.65,8.9 101.65,10.05 J1.9 | v122.91,11.19 123.37,11.19 123.83,10.73 135.49,10.73 143.03,18.28 153.32,18.28 160.17,25.13 160.17,38.39 154.46,44.11 154.46,61.25 152.86,62.85 152.86,83.43 150.35,85.94 v143.72,85.94 | 120.17,73.83 v120.17,77.94
LSOUT2  (via drill 0.25)
  Top 0.254: v40.85,54.4 46.56,48.68 46.79,48.68 53.42,42.05 U$2.30 | v89.99,4.1 v92.51,4.1
  Bottom 0.254: v40.85,54.4 38.33,56.91 38.33,80.91 42.67,85.26 63.02,85.26 70.79,93.03 70.79,98.29 71.48,98.97 71.94,98.97 76.05,94.86 91.59,94.86 115.14,71.31 121.77,71.31 U$1.34/A15 | v92.51,4.1 95.02,4.1 96.4,5.47 96.4,7.08 98.91,9.59 98.91,10.05 J1.11 | v89.99,4.1 76.05,4.1 57.3,22.85 52.5,22.85 51.82,23.53 51.82,40.45 53.19,41.82 U$2.30
LSOUT3  (via drill 0.25)
  Top 0.254: v41.53,66.51 43.59,64.45 43.59,56 45.87,53.71 46.1,53.71 51.82,47.99 51.82,45.94 53.19,44.57 U$2.29 53.42,44.34 54.79,42.97 v54.79,26.28 | v77.19,14.16 79.94,11.42 84.28,11.42 84.97,10.73 84.97,9.59 85.88,8.68 94.34,8.68 95.71,10.05 96.4,10.05 J1.13
  Bottom 0.254: U$1.35/A16 91.59,68.57 89.54,70.63 89.54,70.85 86.57,73.83 68.28,73.83 66.22,71.77 65.76,71.77 60.28,77.26 46.56,77.26 43.82,80 42.45,80 41.53,79.08 v41.53,66.51 | v77.19,14.16 66.91,14.16 v54.79,26.28
MISO  (via drill 0.25)
  Top 0.254: v113.54,57.37 113.54,54.85 112.85,54.17 112.4,54.17 107.37,49.14 100.97,49.14 99.14,47.31 98,47.31 97.77,47.54 97.77,48.22 U3.12 | v127.26,59.65 v124.28,59.65 | v66.22,66.05 66.22,65.83 62.11,61.71 62.11,60.11 55.02,53.02 55.02,51.88 53.42,50.28 53.42,49.59 U$2.27
  Bottom 0.254: v124.28,59.65 121.31,59.65 119.03,57.37 v113.54,57.37 112.63,57.37 103.48,66.51 90.22,66.51 87.94,68.8 84.05,68.8 80.85,72 75.14,72 70.34,67.2 67.82,67.2 66.68,66.05 v66.22,66.05 | v127.26,59.65 127.26,59.2 130.69,55.77 130.69,49.14 131.37,48.45 136.86,48.45 U$1.12/MISO
MOSI  (via drill 0.25)
  Top 0.254: v99.37,48.68 99.14,48.45 98.45,48.45 U3.13 | v92.05,56 92.05,60.34 v90.22,62.17 | v64.39,65.14 64.39,64.68 54.56,54.85 54.56,53.25 53.42,52.11 U$2.26 | v130.69,45.71 130,45.71 v128.4,47.31
  Bottom 0.254: v92.05,56 v99.37,48.68 | v64.39,65.14 66.45,65.14 67.36,66.05 69.88,66.05 74.91,71.08 81.08,71.08 83.82,68.34 87.71,68.34 90.22,65.83 v90.22,62.17 90.45,61.94 107.37,61.94 112.85,56.45 118.8,56.45 119.48,57.14 124.97,57.14 128.63,53.48 128.63,53.02 128.4,52.8 v128.4,47.31 | v130.69,45.71 U$1.11/MOSI
N$1
  Top 0.762: J26.2 36.71,71.11 34.17,73.65 34.17,126.99 51.64,144.46 61.59,151.12 67.19,151.12 | 67.19,151.12 J12.1 67.82,151.25 68.71,152.13 | 68.71,152.13 69.35,152.77 82.04,152.77 S1.2 | 68.71,152.13 68.2,152.13 67.19,151.12
N$3  (via drill 0.25)
  Top 0.254: v130.69,44.57 127.26,44.57 126.57,43.88 126.11,43.88 v124.51,45.48 | v91.59,33.36 95.94,29.02 97.08,29.02 100.05,31.99 100.05,33.59 100.74,34.28 102.8,34.28 v103.71,35.19
  Bottom 0.254: v130.69,44.57 131.37,45.25 134.11,45.25 134.8,44.57 134.8,41.14 136.63,39.31 142.34,39.31 143.49,38.16 147.14,38.16 U$3.P8 | v124.51,45.48 123.37,45.48 122.23,44.34 121.31,44.34 116.51,39.54 116.51,38.62 115.37,37.48 95.48,37.48 91.59,33.59 v91.59,33.36 | v103.71,35.19 106.45,35.19 106.68,35.42 J16.1
N$4
  Bottom 0.254: U$3.P6 141.89,37.02 140.52,37.02 139.83,37.71 138.46,37.71 137.54,36.79 135.03,36.79 130,31.76 117.2,31.76 115.6,33.36 115.6,35.88 114.91,36.56 109.65,36.56 107.37,34.28 102.8,34.28 101.65,35.42 J14.1
N$6  (via drill 0.25)
  Top 0.254: v138.69,32.45 138.69,27.88 137.31,26.51 136.4,26.51 134.8,24.91 134.8,23.08 v136.17,21.71 | v143.72,27.42 145.54,27.42 148.29,30.16 148.29,43.88 v148.52,44.11 | v141.43,84.11 143.03,84.11 145.32,86.4 145.32,86.86 144.63,87.54 131.37,87.54 125.88,82.06 125.88,81.14 123.6,78.86 116.28,78.86 114.91,77.48 97.77,77.48 92.74,72.45 90.45,72.45 v88.62,70.63 | v66.91,54.85 66.91,46.62 67.82,45.71 69.19,45.71 70.11,44.79 70.11,30.62 72.85,27.88 80.39,27.88 85.88,33.36 85.88,34.28 87.02,35.42 96.4,35.42 J15.1
  Bottom 0.254: v138.69,32.45 139.14,32.91 141.89,32.91 U$3.P3 | v136.17,21.71 138,21.71 v143.72,27.42 | v148.52,44.11 148.52,45.02 143.49,50.05 143.49,82.06 v141.43,84.11 | v88.62,70.63 84.28,70.63 81.54,73.37 70.56,73.37 62.56,65.37 62.56,58.74 66.45,54.85 v66.91,54.85
N$11
  Bottom 0.254: J17.6 153.55,49.77 153.55,26.53 J18.2
N$34  (via drill 0.35)
  Top 0.762: 3U1.P4 85.81,97.35 84.63,96.17 3D1.A 86.24,89.23 v86.24,90.16 | 3L1.P2 74.81,73.96 v74.81,81.27
  Bottom 0.762: v74.81,81.27 83.7,90.16 v86.24,90.16
N$35
  Bottom 0.254: 3C6.2 3R4.1
  Bottom 0.508: 3Q2.3 87.38,52.35 89.33,52.35 3C6.2
  Bottom 0.762: 3Q2.3 85.17,54.56 84.64,54.56 81.59,57.61 81.59,60.26 77.68,64.18 77.68,67.88 78.49,68.7 78.74,68.7 3Q1.3
N$36
  Top 0.254: 3U1.P1 85.83,102.45 83.28,99.9 3R1.2
N$37
  Top 0.254: 3R1.1 3C2.1
N$38  (via drill 0.35)
  Top 0.254: v83.7,50.79 v83.7,57.14
  Bottom 0.254: 3R3.2 83.7,50.37 v83.7,50.79 | v83.7,57.14 82.3,58.53 82.3,60.56 79.89,62.98 3Q1.1
N$39
  Top 0.762: 3D2.C 74.81,43.17 3D3.C
N$40
  Bottom 0.508: 3R5.1 87.27,51.64 87.87,51.03 88.95,51.03 3C6.1
N$42
  Bottom 0.762: 3Q3.3 109.1,43.2 107.99,44.31 107.7,44.31 106.89,45.13 106.89,45.73 105.61,47.01 105.25,47.01 104.19,48.08 3Q4.3 101.89,48.08 99.92,50.05 99.92,50.22 3C7.2 3R8.1
N$43
  Bottom 0.254: 3Q3.1 104.02,53.33 3R7.2
N$44
  Top 0.762: 3D4.C 3D5.C
N$45
  Bottom 0.762: 3C7.1 101.91,49.94 3R10.1
N$47
  Top 0.762: 4U1.P2 131.12,113.86 135.64,109.34 | 135.64,109.34 3L2.1 | 135.64,109.34 132.97,106.67 3D6.C
N$103
  Top 0.254: 83.57,97.32 81.49,95.24 3R2.2 | 3U1.P2 85.86,100.75 84.16,99.05 84.16,97.91 83.57,97.32 | 3U2.7 72.9,100.71 73.75,101.56 75.86,101.56 76.56,100.86 76.56,98.57 77.81,97.32 83.57,97.32
NEOPIXEL  (via drill 0.25)
  Top 0.254: v144.17,37.02 144.17,38.39 140.97,41.59 | 140.97,41.59 139.83,42.74 139.14,42.74 138.23,41.82 138.23,39.31 137.09,38.16 U$1.8 | v40.39,42.05 53.19,29.25 U$2.35 | v111.94,96.46 129.77,96.46 137.77,88.46 v139.14,88.46 | v145.09,45.25 144.63,45.25 140.97,41.59
  Bottom 0.254: v144.17,37.02 147.14,37.02 U$3.P9 | v40.39,42.05 40.39,47.99 37.42,50.97 37.42,81.37 48.39,92.34 68.05,92.34 69.88,94.17 69.88,98.74 71.02,99.89 108.51,99.89 v111.94,96.46 | v139.14,88.46 139.14,59.88 143.03,56 143.03,47.54 145.09,45.48 v145.09,45.25
PWMESC1  (via drill 0.25)
  Top 0.254: v76.74,53.25 79.71,53.25 82.91,56.45 82.91,57.6 84.05,58.74 v88.39,58.74 | v108.05,51.88 v100.51,59.42 | v114.68,45.25 120.63,45.25 121.54,44.34 122.23,44.34 123.37,43.19 123.37,40.68 126.57,37.48 129.09,37.48 129.77,36.79 129.77,36.34 130.46,35.65 136.86,35.65 U$1.7
  Bottom 0.254: U$3.P4 140.73,34.28 139.46,35.55 U$1.7 | v76.74,53.25 73.08,53.25 71.94,54.4 68.51,54.4 U$2.16 | v88.39,58.74 92.74,58.74 93.42,59.42 v100.51,59.42 | v114.68,45.25 v108.05,51.88
PWMESC2  (via drill 0.25)
  Top 0.254: v69.88,80.46 59.13,69.71 50.45,69.71 44.05,63.31 44.05,56.22 45.65,54.62 53.19,54.62 U$2.25 | v89.99,82.06 91.82,82.06 101.65,91.89 106.23,91.89 111.94,97.6 v143.94,97.6 | v155.37,44.34 155.37,40.91 148.74,34.28 148.74,29.71 v145.54,26.51
  Bottom 0.254: U$1.6 139.58,30.47 U$3.P1 142.12,30.39 145.54,26.96 v145.54,26.51 | v69.88,80.46 75.82,80.46 77.42,82.06 v89.99,82.06 | v143.94,97.6 143.94,92.8 149.66,87.09 150.57,87.09 153.55,84.11 153.55,62.85 155.37,61.02 v155.37,44.34
PWMM1
  Bottom 0.254: U$1.2 135.94,22.85 133.89,20.79 124.06,20.79 122.46,19.19 120.17,19.19 119.94,19.42 117.43,19.42 115.14,17.13 111.03,17.13 106.68,12.79 J1.6
PWMM2
  Bottom 0.254: U$1.3/CANTX 137.09,25.59 137.09,26.28 138.23,27.42 138.23,31.08 137.54,31.76 130.69,31.76 125.43,26.51 119.94,26.51 119.71,26.28 113.77,26.28 113.54,26.51 103.48,26.51 98.91,21.93 98.91,12.79 J1.12
PWMM3  (via drill 0.25)
  Top 0.254: v124.51,15.08 126.8,15.08 128.86,17.13 128.86,19.88 136.86,27.88 U$1.4/CANRX | v114.45,14.85 112.85,14.85 v109.65,18.05 | v99.82,18.05 96.62,18.05 91.37,12.79 J1.18
  Bottom 0.254: v124.51,15.08 123.37,15.08 122.23,13.93 115.37,13.93 v114.45,14.85 | v99.82,18.05 v109.65,18.05
PWMM4  (via drill 0.25)
  Top 0.254: v114.91,23.31 v117.88,23.31 | v91.82,21.93 v100.05,21.93 | v84.97,15.08 84.97,13.93 83.82,12.79 J1.24
  Bottom 0.254: v117.88,23.31 120.17,23.31 120.86,23.99 122.46,23.99 122.91,23.53 122.91,22.62 123.83,21.71 124.97,21.71 133.66,30.39 136.86,30.39 U$1.5 | v114.91,23.31 110.34,23.31 109.2,24.45 106.45,24.45 103.94,21.93 v100.05,21.93 | v84.97,15.08 v91.82,21.93
RX  (via drill 0.25)
  Top 0.254: v158.8,41.82 v158.8,27.19 | v77.65,145.84 v116.74,145.84
  Bottom 0.254: v158.8,27.19 158.8,25.13 156.75,23.08 146,23.08 140.74,17.82 137.09,17.82 U$1.0/RX | v158.8,41.82 159.72,42.74 159.72,123.89 157.89,125.72 136.86,125.72 v116.74,145.84 | v77.65,145.84 72.39,151.09 J12.3
RX_BT
  Bottom 0.254: U$1.9/CS 144.66,40.63 145.93,41.9 150.52,41.9 151.26,42.64 151.26,43.69 149.74,45.22 J17.3
S0  (via drill 0.25)
  Top 0.254: v146.92,83.2 137.31,83.2 125.66,71.54 125.66,70.63 122,66.97 122,66.05 U$1.36/A17
  Bottom 0.254: v146.92,83.2 147.37,83.2 149.43,85.26 150.35,85.26 152.4,83.2 152.4,51.65 154,50.05 154,33.14 159.72,27.42 159.72,25.36 153.09,18.73 142.34,18.73 134.8,11.19 124.06,11.19 123.14,12.1 121.31,12.1 115.37,6.16 112.4,6.16 111.25,5.02 110.8,5.02 110.11,5.7 110.11,8.68 111.48,10.05 J1.1
S1
  Bottom 0.254: U$1.37/A18 122,63.31 122.46,63.31 129.77,56 129.77,43.65 124.97,38.85 124.97,38.39 123.83,37.25 122.68,37.25 122.23,36.79 117.43,36.79 116.74,36.11 116.06,36.11 115.14,37.02 95.71,37.02 92.51,33.82 92.51,29.94 86.34,23.76 86.34,18.96 83.82,16.45 82.22,16.45 78.34,12.56 78.34,10.28 77.65,9.59 77.65,5.7 78.79,4.56 89.31,4.56 89.77,5.02 90.45,5.02 92.28,3.19 94.8,3.19 96.4,4.79 105.08,4.79 108.97,8.68 108.97,10.05 J1.3
S2  (via drill 0.25)
  Top 0.254: v124.06,38.62 124.06,37.71 126.8,34.96 126.8,31.08 v127.03,30.85 | v117.88,27.65 117.88,25.59 v116.51,24.22 | v113.54,15.76 v113.54,21.25
  Bottom 0.254: v124.06,38.62 129.31,43.88 129.31,53.48 128.86,53.94 128.86,56.22 124.28,60.8 122,60.8 U$1.38/A19 | v127.03,30.85 123.83,30.85 122.23,29.25 120.4,29.25 118.8,27.65 v117.88,27.65 | v116.51,24.22 116.51,23.76 114,21.25 v113.54,21.25 | v113.54,15.76 113.54,12.79 112.17,11.42 107.83,11.42 J1.5
S3  (via drill 0.25)
  Top 0.254: v124.28,40.91 124.28,42.97 123.6,43.65 123.6,45.71 122.46,46.85 121.54,46.85 119.71,48.68 119.71,55.54 121.77,57.6 121.77,58.28 U$1.39/A20 | v123.14,39.76 123.14,37.94 126.11,34.96 126.11,16.9 v126.57,16.45 | v105.08,5.93 v111.03,5.93
  Bottom 0.254: v123.14,39.76 v124.28,40.91 | v126.57,16.45 126.57,15.3 123.83,12.56 121.08,12.56 115.14,6.62 111.71,6.62 v111.03,5.93 | v105.08,5.93 105.08,9.13 104.17,10.05 J1.7
SCL  (via drill 0.25)
  Top 0.254: 120.17,31.31 118.8,29.94 118.8,19.42 v119.71,18.51 | 120.17,31.31 121.77,32.91 U$1.19/A5/SCL | v117.88,16.68 117.88,13.7 111.48,7.3 103.25,7.3 100.74,4.79 99.37,4.79 97.77,6.39 J2.3 | v146.92,82.06 146.92,76.8 137.31,67.2 136.4,67.2 132.97,63.77 v132.97,38.85 | J4.3 95.02,153.38 94.11,153.38 87.48,146.75 77.42,146.75 41.53,110.86 41.53,80.46 43.13,78.86 J6.3 | 120.17,31.31 117.66,33.82 116.51,33.82 v115.14,32.45 | v108.97,38.62 v111.94,35.65
  Bottom 0.254: U$1.19/A5/SCL R2.1 124.97,33.14 125.88,34.05 130.46,34.05 133.2,36.79 133.2,37.25 132.97,37.48 v132.97,38.85 | v117.88,16.68 v119.71,18.51 | v146.92,82.06 147.6,81.37 149.43,81.37 J8.3 | 78.56,36.34 86.11,43.88 91.59,43.88 93.65,41.82 J13.5 93.88,41.59 96.85,38.62 v108.97,38.62 | 78.56,36.34 68.96,26.73 68.51,26.73 U$2.5 | 78.56,36.34 69.19,45.71 67.82,45.71 67.13,46.39 67.13,53.48 62.11,58.51 62.11,58.97 43.36,77.71 43.36,78.63 J6.3 | v111.94,35.65 v115.14,32.45
SCLK  (via drill 0.25)
  Top 0.254: U3.14 98.68,49.59 107.14,49.59 v112.63,55.08 v112.63,58.51 | v66.91,67.43 67.13,67.2 67.13,65.83 62.56,61.25 62.56,56.91 53.42,47.77 53.42,47.08 U$2.28
  Bottom 0.254: v112.63,55.08 120.86,55.08 121.31,54.62 122.23,54.62 122.91,53.94 122.91,49.37 U$1.13/SCK | v66.91,67.43 67.36,67.43 69.88,69.94 72.39,69.94 74.91,72.45 81.08,72.45 84.28,69.25 88.17,69.25 90.45,66.97 104.17,66.97 v112.63,58.51
SDA  (via drill 0.25)
  Top 0.254: v111.71,27.42 v117.2,32.91 | v108.51,27.42 116.74,19.19 116.74,13.25 111.25,7.76 101.65,7.76 100.28,6.39 J2.4 | v98.45,31.76 98.45,35.42 96.17,37.71 v94.57,37.71 88.62,37.71 84.05,33.14 84.05,32.22 80.62,28.79 v73.08,28.79 | J4.4 92.51,153.61 86.11,147.21 77.19,147.21 41.07,111.09 41.07,78.17 42.9,76.34 J6.4 | v148.74,77.48 148.29,77.94 148.29,81.83 149.66,83.2 149.66,83.66 J8.4
  Bottom 0.254: R1.1 U$1.18/A4/SDA 121.77,35.42 119.71,35.42 v117.2,32.91 | v111.71,27.42 v108.51,27.42 102.8,27.42 v98.45,31.76 | v94.57,37.71 91.37,40.91 91.37,41.82 J13.6 | J6.4 43.13,76.11 43.82,76.11 66.68,53.25 66.68,25.82 68.28,24.22 U$2.4 68.51,24.22 v73.08,28.79 | v148.74,77.48 148.74,77.94 140.06,86.63 140.06,99.2 135.71,103.54 135.71,125.72 108.97,152.46 108.97,154.29 108.28,154.98 103.48,154.98 100.74,152.24 94.11,152.24 92.74,153.61 J4.4
SOLENOID-  (via drill 0.35)
  Top 0.762: 3D3.A 77.35,60.95 77.35,65.01 78.49,66.16 78.74,66.16 3Q1.2
  Top 1.016: v87.51,67.3 111.18,67.3 121.29,77.41 124.2,77.41 3J2.2
  Bottom 0.508: 3D3.A 80.76,57.54 80.76,55.42 3R5.2
  Bottom 1.016: v87.51,67.3 3Q1.2
SOLENOID-1
  Top 0.762: 3D5.A 115.45,62.22 115.45,48.25 112.91,45.71 3Q3.2
  Top 1.016: 3J2.3 127.99,76.19 121.8,76.19 115.45,69.84 115.45,62.22
  Bottom 0.762: 3R10.2 104.58,51.07 104.76,51.07 106.6,49.23 106.6,47.38 108.28,45.71 3Q3.2
SOLENOIDON1
  Bottom 0.254: 3Q2.1 85.42,55.54 85.88,55.54 86.79,54.62 89.08,54.62 3R6.2 89.31,54.62 92.28,57.6 111.03,57.6 112.63,56 121.77,56 U$1.21/DAC0
SOLENOIDON2
  Bottom 0.254: 3R9.2 103.97,46.98 3Q4.1 105.08,45.94 105.08,44.57 109.65,39.99 111.25,39.99 120.63,49.37 120.63,52.11 121.77,53.25 U$1.A22/DAC1
TX  (via drill 0.25)
  Top 0.254: v152.63,31.76 152.63,36.79 v158.8,42.97 | v123.37,102.86 v137.54,102.86
  Bottom 0.254: v152.63,31.76 141.2,20.33 137.09,20.33 U$1.1/TX | v158.8,42.97 158.8,101.94 157.89,102.86 v137.54,102.86 | v123.37,102.86 122.91,102.86 74.91,150.86 J12.4
TX_BT
  Bottom 0.254: U$1.10/CS 139.12,41.09 144.47,41.09 145.74,42.36 148.47,42.36 149.28,43.17 J17.2
VCC_2
  Top 0.254: 3U2.6 3U2.5 75.44,98.41 77.35,96.51 77.35,94.9 80.23,92.02 3D1.C
  Top 0.762: 3D1.C 90.05,77.8 91.66,76.19
  Top 1.016: 3J2.1 101.48,82.54 95.13,76.19 3C4.+ 91.66,76.19 3D1.C | 90.05,77.8 90.05,73.65 84.97,68.57 3D4.A 81.72,60.24 81.72,56.52 79.79,54.6 3D2.A
XSHUT1  (via drill 0.25)
  Top 0.254: v115.83,18.96 115.83,15.08 114.68,13.93 112.85,13.93 109.43,17.36 108.97,17.36 107.83,16.22 107.83,9.59 106.45,8.22 v95.02,8.22
  Bottom 0.254: v115.83,18.96 116.74,19.88 118.8,19.88 121.77,22.85 U$1.23/A9 | v95.02,8.22 84.97,8.22 84.51,7.76 81.31,7.76 79.71,6.16 J3.1
XSHUT2  (via drill 0.25)
  Top 0.254: v130.23,33.14 v130.23,28.56 | v133.89,44.34 133.89,61.94 136.86,64.91 137.54,64.91 147.83,75.2 147.83,85.94 144.86,88.91 144.86,119.32 v131.83,132.35
  Bottom 0.254: v130.23,28.56 125.88,24.22 123.83,24.22 122.68,25.36 122,25.36 U$1.22/A8 | v130.23,33.14 133.89,36.79 v133.89,44.34 | v131.83,132.35 110.57,153.61 J5.1
XSHUT3
  Bottom 0.254: U$1.48 123.6,68.57 122.23,69.94 90.91,69.94 89.99,70.85 89.99,71.08 83.14,77.94 60.96,77.94 57.53,81.37 50.68,81.37 J7.1
XSHUT4
  Top 0.254: J9.1 142.12,77.03 137.54,72.45 129.09,72.45 127.94,71.31 127.03,71.31 U$1.47

## Text on the board
tPlace: ON | OFF | SDA | SCL | GND | 3V3 | GPIO | XSHUT | VL53L0X TOF | 5V | GND | TX | RX | RASPI SERIAL | RASPI POWER | LM2596 | LM2587 | 3V3 | SDA | XSHUT | GPIO | GND | SCL | VL53L0X TOF | VL53L0X TOF | SCL | GND | GPIO | XSHUT | 60v | SOLE-1 | SOLE-2 | SDA | 3V3 | RASPI USB | 5V | GND | INDUCTOR | 1500uF | 12v | KEY | ESC / Power | 3V3 | GND | GND | HC-05 / Bluetooth | TX | ATX | LRX | RX | STATE | 3V3 | GND | SDA | SCL | I2C | INT | RES | BOOT | BNO055 Compass | DATA | ESC | ESC | NEOPIXEL RING | 5V | GND | 12v | GND | AT / Mode | Data / Mode | XSHUT | GPIO | 3V3 | GND | SCL | SDA | VL53L0X TOF
bPlace: 74HCT08 / AND GATE